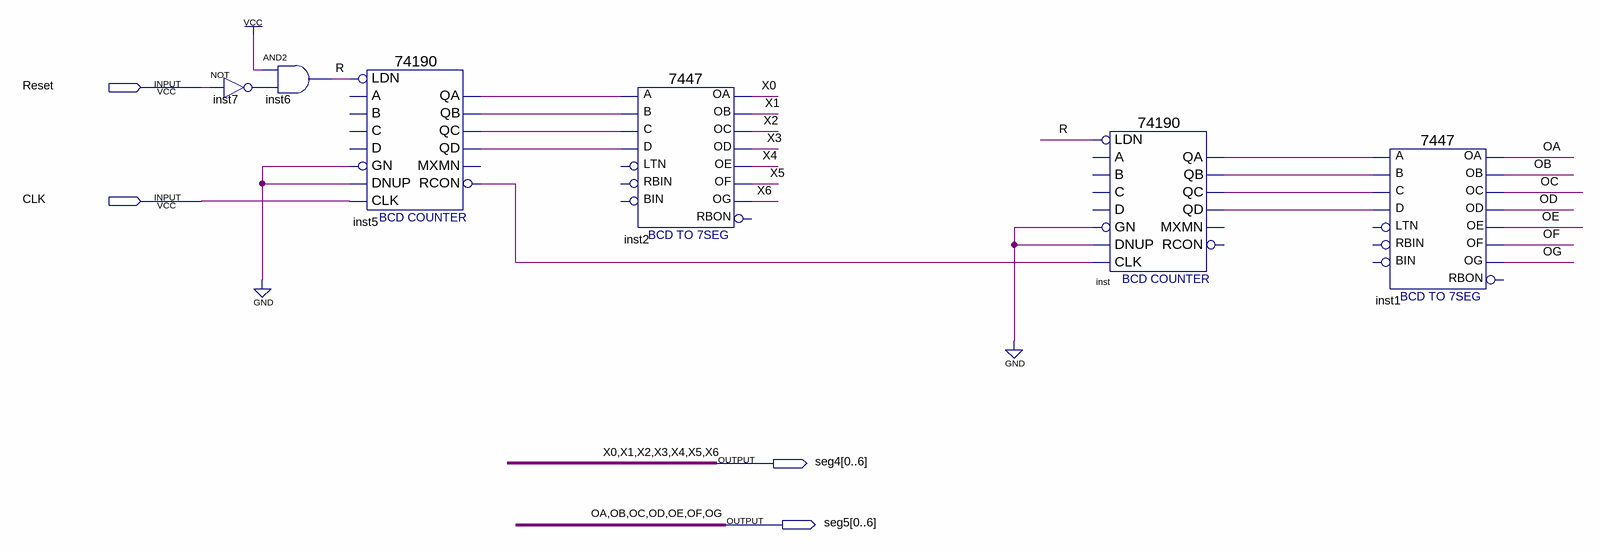
[diagram p0: schematic sheet]
// Quartus schematic turn_counter.bdf as structural Verilog: 6 symbols, 4 pins
module turn_counter (
  input  Reset,
  input  CLK,
  output [0:6] seg4,
  output [0:6] seg5
);

  wire inst5_qa, inst5_qb, inst5_qc, inst5_qd, inst5_rcon, inst7_out, inst_qa, inst_qb, inst_qc, inst_qd, R;

  not inst7 (inst7_out, Reset);
  and inst6 (R, 1'b1, inst7_out);
  \74190  inst5 (
    .LDN(R), .GN(1'b0), .CLK(CLK), .DNUP(1'b0), .QA(inst5_qa), .QB(inst5_qb), .QD(inst5_qd), .QC(inst5_qc),
    .RCON(inst5_rcon));  // open: A, C, B, D, MXMN
  \7447  inst2 (
    .B(inst5_qb), .C(inst5_qc), .D(inst5_qd), .A(inst5_qa), .OB(seg4[1]), .OC(seg4[2]), .OE(seg4[4]),
    .OD(seg4[3]), .OF(seg4[5]), .OG(seg4[6]), .OA(seg4[0]));  // open: LTN, RBIN, BIN, RBON
  \74190  inst (
    .LDN(R), .GN(1'b0), .CLK(inst5_rcon), .DNUP(1'b0), .QA(inst_qa), .QB(inst_qb), .QD(inst_qd), .QC(inst_qc));  // open: A, C, B, D, MXMN, RCON
  \7447  inst1 (
    .B(inst_qb), .C(inst_qc), .D(inst_qd), .A(inst_qa), .OB(seg5[1]), .OC(seg5[2]), .OE(seg5[4]),
    .OD(seg5[3]), .OF(seg5[5]), .OG(seg5[6]), .OA(seg5[0]));  // open: LTN, RBIN, BIN, RBON

  // Other names for the same wires on the sheet: OA = seg5[0]; OB = seg5[1]; OC = seg5[2]; OD = seg5[3]; OE = seg5[4];
  //   OF = seg5[5]; OG = seg5[6]; X0 = seg4[0]; X1 = seg4[1]; X2 = seg4[2]; X3 = seg4[3]; X4 = seg4[4]; X5 = seg4[5];
  //   X6 = seg4[6]
endmodule
